# EAGLE schematic open-lab-VUSB-D (EAGLE 6.5.0)
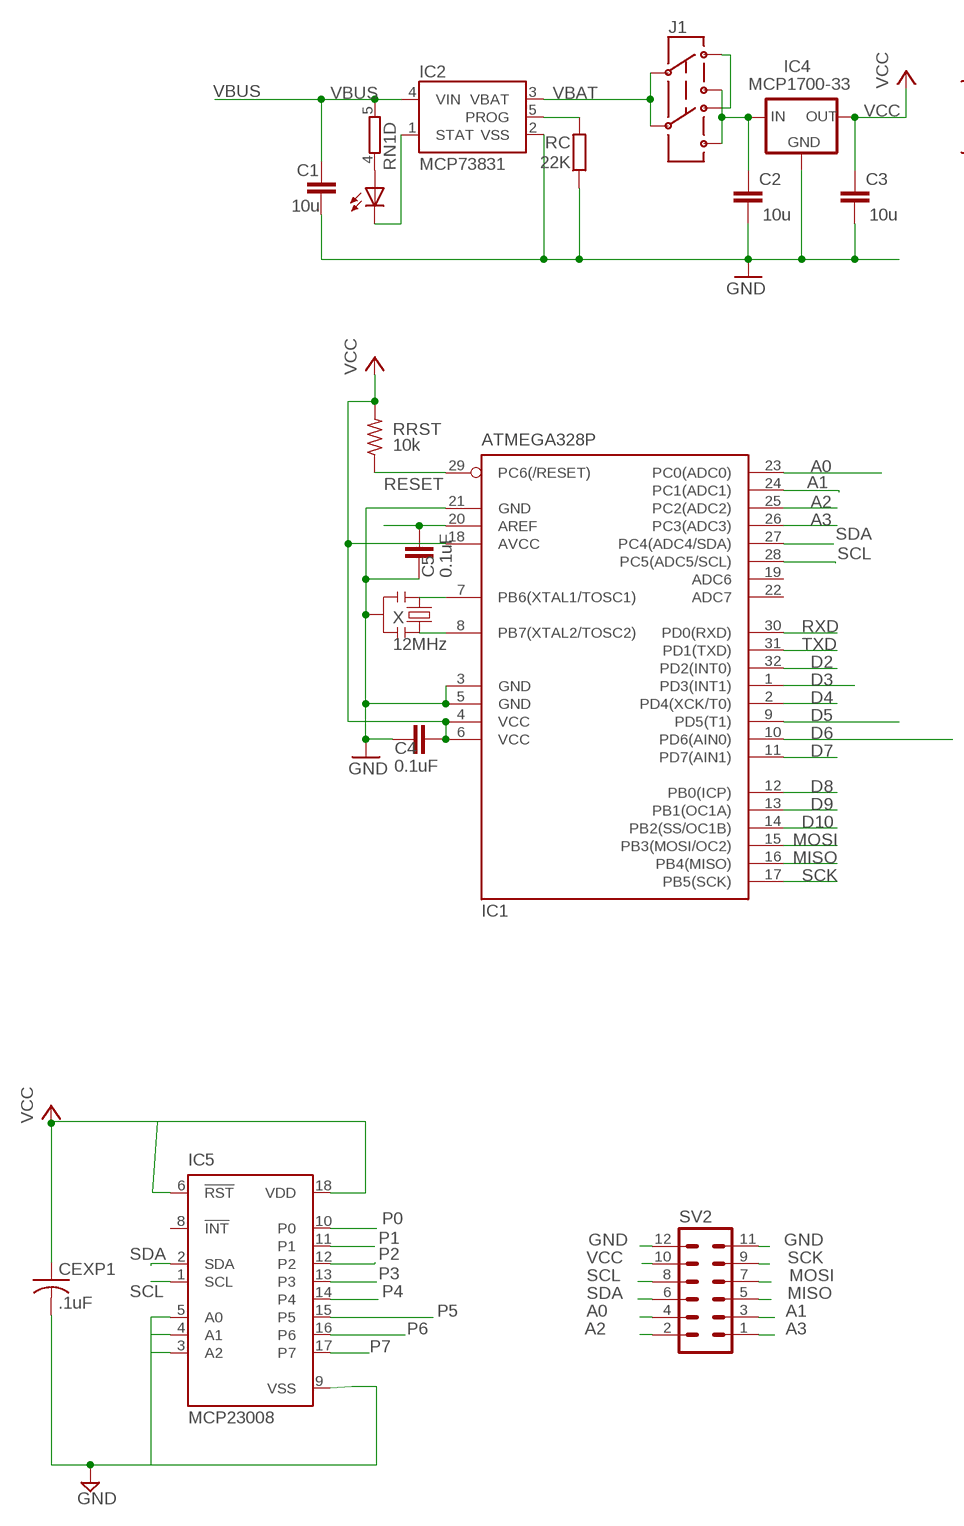
[diagram p0: schematic, sheet 1, part 1 of 2]
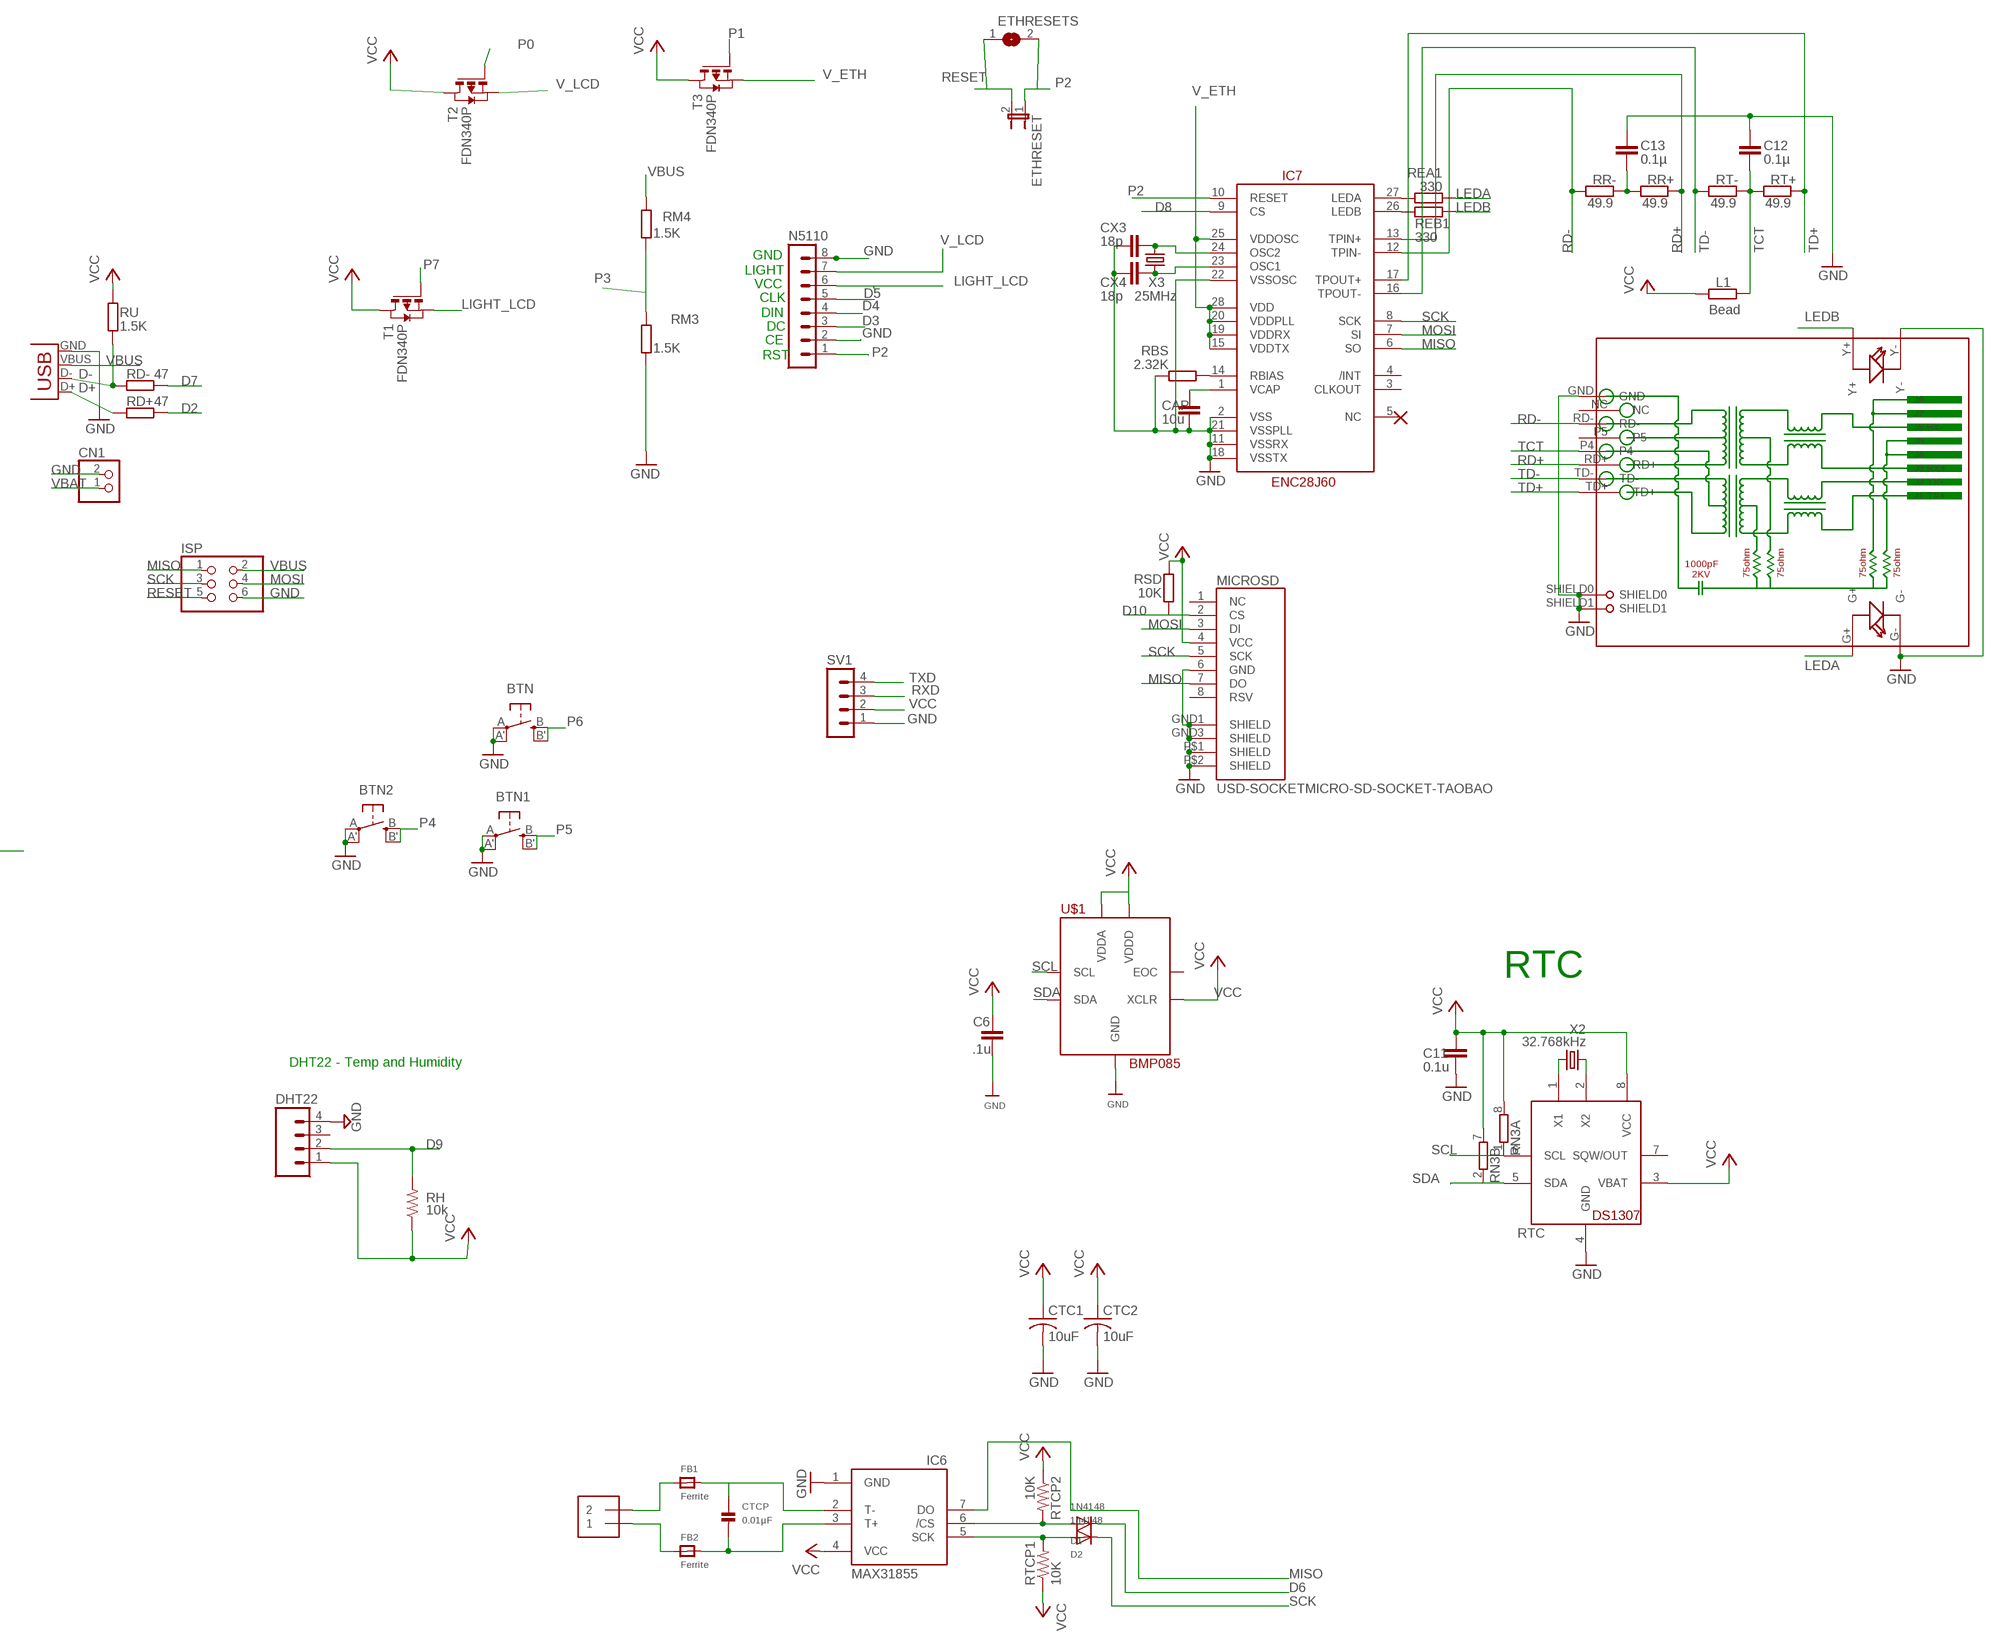
[diagram p1: schematic, sheet 1, part 2 of 2]

## Parts
BTN  EVQQ2  [EVQ-Q2]
BTN1  EVQQ2  [EVQ-Q2]
BTN2  EVQQ2  [EVQ-Q2]
C1  10u  C-EUC0805  [C0805]
C2  10u  C-EUC0805  [C0805]
C3  10u  C-EUC0805  [C0805]
C4  0.1uF  C-EUC0805  [C0805]
C5  0.1uF  C-EUC0805  [C0805]
C6  .1u  C-EUC0805  [C0805]
C11  0.1u  C-EUC0805  [C0805]
C12  0.1µ  C-EUC0805  [C0805]
C13  0.1µ  C-EUC0805  [C0805]
CAP  10u  C-EUC0805  [C0805]
CEXP1  .1uF  C-USC0805K  [C0805K]
CHG  0805  LEDCHIPLED_0805  [CHIPLED_0805]
CN1  JST_2PIN-SMT-RA  [JST-PH-2-SMT-RA]
CTC1  10uF  C-USC0805K  [C0805K]
CTC2  10uF  C-USC0805K  [C0805K]
CTCP  0.01µF  CAP_CERAMIC_0805  [_0805]
CX3  18p  C-EUC0805  [C0805]
CX4  18p  C-EUC0805  [C0805]
D1  1N4148  DIODESOD-323F  [SOD-323F]
D2  1n4148  DIODESOD-323F  [SOD-323F]
DHT22  M04LOCK  [1X04_LOCK]
ETHRESET  JP1E  [JP1]
ETHRESETS  SJ  [SJ]
FB1  Ferrite  FERRITE_0805  [_0805]
FB2  Ferrite  FERRITE_0805  [_0805]
IC1  ATMEGA328P  MEGA8-AI  [TQFP32-08]
IC2  MCP73831  [SOT23-5]
IC4  MCP1700-33  MCP1700SOT233  [SOT23]
IC5  MCP23008  MCP23008T  [SO18W]
IC6  MAX31855  MAX6675  [SO08]
IC7  ENC28J60  ENC28J60SO28LONG  [SOIC28WLONG]
ISP  PINHD-2X3  [2X03]
J1  AYZ0202  [AYZ0202]
L1  Bead  R-EU_R0805  [R0805]
MICROSD  USD-SOCKETMICRO-SD-SOCKET-TAOBAO  [MICRO-SD-SOCKET-TAOBAO]
N5110  MA08-1  [MA08-1]
RBS  2.32K  R-EU_R0805  [R0805]
RC  22K  R-EU_R0805  [R0805]
RD+  47  R-EU_R0805  [R0805]
RD-  47  R-EU_R0805  [R0805]
REA1  330  R-EU_R0805  [R0805]
REB1  330  R-EU_R0805  [R0805]
RH  10k  R-US_R0805  [R0805@1]
RJ45  HR911105A  [HR911105A]
RM3  1.5K  R-EU_R0805  [R0805]
RM4  1.5K  R-EU_R0805  [R0805]
RN1  4R-NEXB38V  [EXB38V]
RN3  4R-NEXB38V  [EXB38V]
RR+  49.9  R-EU_R0805  [R0805]
RR-  49.9  R-EU_R0805  [R0805]
RRST  10k  R-US_R0805  [R0805@1]
RSD  10K  R-EU_R0805  [R0805]
RT+  49.9  R-EU_R0805  [R0805]
RT-  49.9  R-EU_R0805  [R0805]
RTC  DS1307  DS1307SOIC  [SO08]
RTCP1  10K  R-US_R0805  [R0805]
RTCP2  10K  R-US_R0805  [R0805]
RU  1.5K  R-EU_R0805  [R0805]
SV1  MA04-1  [MA04-1]
SV2  MA06-2  [MA06-2]
T1  FDN340P  PMOSSOT23  [SOT-23]
T2  FDN340P  PMOSSOT23  [SOT-23]
T3  FDN340P  PMOSSOT23  [SOT-23]
TCPL  1X2-3.5MM  [1X2-3.5MM]
U$1  BMP085  [BMP085]
X  12MHz  RESONATORSMD  [RESONATOR-SMD]
X1  USBSMD  [USB-MINIB]
X2  32.768kHz  CRYSTALTC26H  [TC26H]
X3  25MHz  CRYSTALHC49UV  [HC49U-V]

## Nets
A0: IC1.23(PC0(ADC0)) SV2.4
A1: IC1.24(PC1(ADC1)) SV2.3
A2: IC1.25(PC2(ADC2)) SV2.2
A3: IC1.26(PC3(ADC3)) SV2.1
AREF: C5.2 IC1.20(AREF)
CS: D1.A IC6.6(/CS) RTCP2.2
D2: IC1.32(PD2(INT0)) RD+.2
D3: IC1.1(PD3(INT1)) N5110.3
D4: IC1.2(PD4(XCK/T0)) N5110.4
D5: IC1.9(PD5(T1)) N5110.5
D6: D1.C IC1.10(PD6(AIN0))
D7: IC1.11(PD7(AIN1)) RD-.2
D8: IC1.12(PB0(ICP)) IC7.9(CS)
D9: DHT22.2 IC1.13(PB1(OC1A)) RH.2
D10: IC1.14(PB2(SS/OC1B)) MICROSD.2(CS) RSD.1
D+: RD+.1 X1.D+
D-: RD-.1 RU.1 X1.D-
GND: BTN1.A'(P1) BTN1.A(P) BTN2.A'(P1) BTN2.A(P) BTN.A'(P1) BTN.A(P) C1.2 C2.2 C3.2 C4.1 C5.1 C6.2 C11.2 C12.1 C13.1 CAP.2 CEXP1.2 CN1.2 CTC1.2 CTC2.2 CX3.2 CX4.2 DHT22.4 IC1.3(GND) IC1.5(GND) IC1.21(GND) IC2.2(VSS) IC4.1(GND) IC5.3(A2) IC5.4(A1) IC5.5(A0) IC5.9(VSS) IC6.1(GND) IC7.2(VSS) IC7.11(VSSRX) IC7.18(VSSTX) IC7.21(VSSPLL) IC7.22(VSSOSC) ISP.6 MICROSD.6(GND) MICROSD.GND1(SHIELD) MICROSD.GND3(SHIELD) MICROSD.P$1(SHIELD) MICROSD.P$2(SHIELD) N5110.2 N5110.8 RBS.1 RC.1 RJ45.G- RJ45.GND RJ45.SHIELD0 RJ45.SHIELD1 RJ45.Y- RM3.1 RTC.4(GND) SV1.1 SV2.11 SV2.12 U$1.P$1(GND) X1.GND X.2
LEDA: REA1.2 RJ45.G+
LEDB: REB1.2 RJ45.Y+
LIGHT_LCD: N5110.6 T1.2(S)
MISO: IC1.16(PB4(MISO)) IC6.7(DO) IC7.6(SO) ISP.1 MICROSD.7(DO) SV2.5
MOSI: IC1.15(PB3(MOSI/OC2)) IC7.7(SI) ISP.4 MICROSD.3(DI) SV2.7
N$1: J1.3 J1.6
N$2: IC1.7(PB6(XTAL1/TOSC1)) X.1
N$3: IC1.8(PB7(XTAL2/TOSC2)) X.3
N$5: CHG.C IC2.1(STAT)
N$6: IC2.5(PROG) RC.2
N$8: FB1.1 TCPL.2
N$9: CTCP.1 FB1.2 IC6.2(T-)
N$10: CHG.A RN1.4
N$11: FB2.1 TCPL.1
N$12: CTCP.2 FB2.2 IC6.3(T+)
N$21: RTC.1(X1) X2.2
N$30: RTC.2(X2) X2.1
N$34: IC7.27(LEDA) REA1.1
N$37: IC7.26(LEDB) REB1.1
N$39: CAP.1 IC7.1(VCAP)
N$41: CX3.1 IC7.24(OSC2) X3.2
N$42: CX4.1 IC7.23(OSC1) X3.1
N$54: C13.2 RR+.2 RR-.1
N$59: IC7.14(RBIAS) RBS.2
P0: IC5.10(P0) T2.3(G)
P1: IC5.11(P1) T3.3(G)
P2: ETHRESET.1 ETHRESETS.2 IC5.12(P2) IC7.10(RESET) N5110.1
P3: IC5.13(P3) RM3.2 RM4.1
P4: BTN2.B'(S1) BTN2.B(S) IC5.14(P4)
P5: BTN1.B'(S1) BTN1.B(S) IC5.15(P5)
P6: BTN.B'(S1) BTN.B(S) IC5.16(P6)
P7: IC5.17(P7) T1.3(G)
RD+: IC7.13(TPIN+) RJ45.RD+ RR+.1
RD-: IC7.12(TPIN-) RJ45.RD- RR-.2
RESET: ETHRESET.2 ETHRESETS.1 IC1.29(PC6(/RESET)) ISP.5 RRST.1
RXD: IC1.30(PD0(RXD)) SV1.3
SCK: D2.C IC1.17(PB5(SCK)) IC7.8(SCK) ISP.3 MICROSD.5(SCK) SV2.9
SCK1: D2.A IC6.5(SCK) RTCP1.2
SCL: IC1.28(PC5(ADC5/SCL)) IC5.1(SCL) RN3.1 RTC.6(SCL) SV2.8 U$1.P$6(SCL)
SDA: IC1.27(PC4(ADC4/SDA)) IC5.2(SDA) RN3.2 RTC.5(SDA) SV2.6 U$1.P$7(SDA)
TCT: C12.2 L1.1 RJ45.P4 RT+.2 RT-.1
TD+: IC7.17(TPOUT+) RJ45.TD+ RT+.1
TD-: IC7.16(TPOUT-) RJ45.TD- RT-.2
TXD: IC1.31(PD1(TXD)) SV1.4
V_ETH: IC7.15(VDDTX) IC7.19(VDDRX) IC7.20(VDDPLL) IC7.25(VDDOSC) IC7.28(VDD) T3.2(S)
V_LCD: N5110.7 T2.2(S)
VBAT: CN1.1 IC2.3(VBAT) J1.2 J1.5
VBUS: C1.1 IC2.4(VIN) ISP.2 RM4.2 RN1.5 X1.VBUS
VCC: C3.1 C4.2 C6.1 C11.1 CEXP1.1 CTC1.1 CTC2.1 DHT22.1 IC1.4(VCC) IC1.6(VCC) IC1.18(AVCC) IC4.2(OUT) IC5.6(!RST) IC5.18(VDD) IC6.4(VCC) L1.2 MICROSD.4(VCC) RH.1 RN3.7 RN3.8 RRST.2 RSD.2 RTC.3(VBAT) RTC.8(VCC) RTCP1.1 RTCP2.1 RU.2 SV1.2 SV2.10 T1.1(D) T2.1(D) T3.1(D) U$1.P$3(VDDA) U$1.P$4(VDDD) U$1.P$8(XCLR)
VDD: C2.1 IC4.3(IN) J1.1 J1.4
Unconnected: DHT22.3 IC1.19(ADC6) IC1.22(ADC7) IC5.8(!INT) IC7.3(CLKOUT) IC7.4(/INT) IC7.5(NC) MICROSD.1(NC) MICROSD.8(RSV) RJ45.NC RJ45.P5 RN1.1 RN1.2 RN1.3 RN1.6 RN1.7 RN1.8 RN3.3 RN3.4 RN3.5 RN3.6 RTC.7(SQW/OUT) U$1.P$2(EOC)

## Notes on the sheet
- GND
- LIGHT
- VCC
- CLK
- DIN
- DC
- CE
- RST
- RTC
- DHT22 - Temp and Humidity

## Library data of the parts
BTN BTN1 BTN2 = adafruit:EVQQ2: SMT 6mm switch, EVQQ2 series http://www.ladyada.net/library/eagle
C1-C3 C6 C12 C13 CAP CX3 CX4 = resistor:C-EU: CAPACITOR, European symbol
C4 C5 C11 = rcl:C-EU: CAPACITOR, European symbol
CEXP1 CTC1 CTC2 = adafruit:C-US: CAPACITOR, American symbol
CHG = led:LED: LED OSRAM: - CHIPLED LG R971, LG N971, LY N971, LG Q971, LY Q971, LO R971, LY R971 LH N974, LH R974 LS Q976, LO Q976, LY Q976 LO Q996 - Hyper CHIPLED LW Q18S LB Q993, LB Q99A, LB R99A - SideLED LS A670, LO A670, LY A670, LG A670, LP A670 LB A673, LV A673, LT A673, LW A673 LH A674 LY A675 LS A676, LA A676, LO A676, LY A676, LW A676 LS A679, LY A679, LG A679 - Hyper Micro SIDELED® LS Y876, LA Y876, LO Y876, LY Y876 LT Y87S - SmartLED LW L88C, LW L88S LB L89C, LB L89S, LG L890 LS L89K, LO L89K, LY L89K LS L896, LA L896, LO L896, LY L896 - TOPLED LS T670, LO T670, LY T670, LG T670, LP T670 LSG T670, LSP T670, LSY T670, LOP T670, LYG T670 LG T671, LOG T671, LSG T671 LB T673, LV T673, LT T673, LW T673 LH T674 LS T676, LA T676, LO T676, LY T676, LB T676, LH T676, LSB T676, LW T676 LB T67C, LV T67C, LT T67C, LS T67K, LO T67K, LY T67K, LW E67C LS E67B, LA E67B, LO E67B, LY E67B, LB E67C, LV E67C, LT E67C LW T67C LS T679, LY T679, LG T679 LS T770, LO T770, LY T770, LG T770, LP T770 LB T773, LV T773, LT T773, LW T773 LH T774 LS E675, LA E675, LY E675, LS T675 LS T776, LA T776, LO T776, LY T776, LB T776 LHGB T686 LT T68C, LB T68C - Hyper Mini TOPLED® LB M676 - Mini TOPLED Santana® LG M470 LS M47K, LO M47K, LY M47K Source: http://www.osram.convergy.de LUXEON: - LUMILED® LXK2-PW12-R00, LXK2-PW12-S00, LXK2-PW14-U00, LXK2-PW14-V00 LXK2-PM12-R00, LXK2-PM12-S00, LXK2-PM14-U00 LXK2-PE12-Q00, LXK2-PE12-R00, LXK2-PE12-S00, LXK2-PE14-T00, LXK2-PE14-U00 LXK2-PB12-K00, LXK2-PB12-L00, LXK2-PB12-M00, LXK2-PB14-N00, LXK2-PB14-P00, LXK2-PB14-Q00 LXK2-PR12-L00, LXK2-PR12-M00, LXK2-PR14-Q00, LXK2-PR14-R00 LXK2-PD12-Q00, LXK2-PD12-R00, LXK2-PD12-S00 LXK2-PH12-R00, LXK2-PH12-S00 LXK2-PL12-P00, LXK2-PL12-Q00, LXK2-PL12-R00 Source: www.luxeon.com KINGBRIGHT: KA-3528ASYC Source: www.kingbright.com
CN1 = adafruit:JST_2PIN: JST 2-Pin Connectors of various flavors SMT-RA (S2B-PH-SM4) 4UConnector #17311 SMT (B2B-PH-SM4) THM-RA (S2B-PH) THM (B2B-PH)
CTCP = microbuilder:CAP_CERAMIC: Ceramic Capacitors 0402 - 0402 Surface Mount Capacitors 16pF 50V 5% [Digikey: 445-4899-2-ND] 18pF 50V 5% [Digikey: 490-1281-2-ND] 22pF 50V 5% [Digikey: 490-1283-2-ND] 68pF 50V 5% [Digikey: 490-1289-2-ND] 0.1uF 10V 10% [Digikey: 490-1318-2-ND] 1.0uF 6.3V 10% [Digikey: 490-1320-2-ND] 0603 - 0603 Surface Mount Capacitors 16 pF 50V 5% [Digikey: 445-5051-2-ND] 22 pF 50V [Digikey: PCC220ACVTR-ND] 33 pF 50V 5% [Digikey: 490-1415-1-ND] 56pF 50V 5% [Digikey: 490-1421-1-ND] 220pF 50V 5% [Digikey: 445-1285-1-ND] 680 pF 50V 2200 pF 50V 5% C0G [Digikey: 445-1297-1-ND] 5600 pF 100V 5% X7R [Digikey: 478-3711-1-ND] 0.1 µF 25V 10% [Digikey: PCC2277TR-ND] 0.22 µF 16V 10% X7R [Digikey: 445-1318-1-ND] 1.0 µF 25V 10% [Digikey: 445-5146-2-ND] 0603 - RF Specific 3pF 250V +/-0.1pF RF [Digikey: 712-1347-1-ND] 18 pF 250V 5% [Digikey: 478-3505-1-ND or 712-1322-1-ND] 56 pF 250V 5% C0G RF [Digikey: 490-4867-1-ND] 68 pF 250V RF [Digikey: 490-4868-1-ND] 0805 - 0805 Surface Mount Capacitors 220 pF 250V 2% RF Ceramic Capacitor [Digikey: 712-1398-1-ND] 1000 pF 50V 2% NP0 Ceramic Capacitor [Digikey: 478-3760-1-ND] 0.1 µF 25V 10% Ceramic Capacitor [Digikey: PCC1828TR-ND] 1.0 µF 16V 10% Ceramic Capacitor[Digikey: 490-1691-2-ND] 10.0 µF 10V 10% Ceramic Capacitor[Digikey: 709-1228-1-ND] 10.0 uF 16V 10% Ceramic Capacitor [Digikey: 478-5165-2-ND] 47 uF 6.3V 20% Ceramic Capacitor [Digikey: 587-1779-1-ND or 399-5506-1-ND] 1206 - 1206 Surface Mount Capacitors 47uF 10V 20% Ceramic Capacitor [Digikey: 490-5528-1-ND or 399-5508-1-ND or 445-6010-1-ND] 100uF 6.3V -20%, +80% Y5V Ceramic Capacitor (Digikey: 490-4512-1-ND, Mouser: 81-GRM31CF50J107ZE1L)
D1 D2 = adafruit:DIODE: Diode SMADIODE - SMA Surface Mount Package 20V 1A Schottky Diode Digikey: 641-1014-6-ND DO-1N4148 - Through Hole Small Current Diode SOD-123 20V 1 A (.5mV Vf) Schottky Diode - Digikey: MBRX120TPMSCT-ND SOD-323 10V 570mA (.38mV Vf, 3ns) Schottky Diode - Digikey: ZLLS410CT-ND SOD-523 30V 30mA Schottky Diode (RB751S-40TE61) - Digikey: RB751S-40TE61CT-ND SOT23-R/W - SOT23 Package (R = Solder Paste/Reflow Ovens, W = Hand-Soldering) BAT54Film 40V 300mA - Digikey: 497-7162-1-ND
DHT22 = SparkFun-Connectors:M04: Header 4 Standard 4-pin 0.1" header. Use with straight break away headers (SKU : PRT-00116), right angle break away headers (PRT-00553), swiss pins (PRT-00743), machine pins (PRT-00117), and female headers (PRT-00115). Molex polarized connector foot print use with SKU : PRT-08231 with associated crimp pins and housings. 1MM SMD Version SKU: PRT-10208
ETHRESET = jumper:JP1E: JUMPER
ETHRESETS = jumper:SJ: SMD solder JUMPER
FB1 FB2 = microbuilder:FERRITE: Ferrite Bead 0603 MMZ1608B121C - 120 Ohm @ 100MHz, 600mA, 0.15 Ohm DC Resistance - Digikey: 445-2164-1-ND BK1608HW121-T - 120 Ohm, 600mA Ferrite Chip - Digikey: 587-1876-2-ND 0805 HZ0805B272R-10 - 2.7K Ohm @ 100MHz, 200mA, 0.8 Ohm DC Resistance - Digikey: 240-2504-1-ND (see also Murata BLM21BD272SN1L) MMZ2012Y152B - 1.5K Ohm @ 100MHz, 500mA, 0.4 Ohm DC Resistance - Digikey: 445-1560-1-ND - Mainly for high frequency (80-400MHz) MMZ2012R102A - 1K Ohm @ 100MHz, 500mA, 0.3 Ohm DC Resistance - Digikey: 445-1555-2-ND - More general purpose (10-200MHz)
IC1 = atmel:MEGA8: MICROCONTROLLER 8 Kbytes FLASH, 1 kbytes SRAM, 512 bytes EEPROM, USART, 6-channel 10 bit ADC, 2-channel 8 bit ADC Pin compatible with Atmega48, ATMega88, ATMega168 Source: avr.lbr; MPN: ATMEGA8-16AU; OC_FARNELL: 9171371; OC_NEWARK: 73M8863
IC2 = SparkFunNew:MCP73831: Microchip's MCP73831 Miniature single cell, fully integrated Li-Ion, Li-polymer charge management controller http://ww1.microchip.com/downloads/en/DeviceDoc/21984a.pdf
IC4 = adafruit:MCP1700: VOLTAGE REGULATOR
IC5 = JeeLabs:MCP23008: I2C-Bus Remote 8-bit I/O expander http://www.semiconductors.philips.com/acrobat_download/datasheets/PCF8574_4.pdf
IC6 = adafruit:MAX6675
IC7 = SparkFun:ENC28J60
ISP = pinhead:PINHD-2X3: PIN HEADER
J1 = SparkFunNew:AYZ0202: SPDT Slide Switch Simple SMD single-pull double-throw slide switch. Good for less than 350mA power switch, switching UARTs between devices, etc. Spark Fun Electronics SKU : COM-00597
L1 RBS RC RD+ RD- REA1 REB1 RM3 RM4 RR+ RR- RSD RT+ RT- RU = rcl:R-EU_: RESISTOR, European symbol
MICROSD = SparkFunNew:USD-SOCKET: microSD Socket Push-push type uSD socket. Schematic element and footprint production proven. Spark Fun Electronics SKU : PRT-00127. tDoc lines correctly indicate media card edge positions when inserting (unlocked, locked, depressed).
N5110 = con-lstb:MA08-1: PIN HEADER; OC_FARNELL: unknown; OC_NEWARK: unknown
RH RRST = rcl:R-US_: RESISTOR, American symbol
RJ45 = CONNECTER:HR911105A
RN1 RN3 = resistor-dil:4R-N: Array Chip Resistor Source: RS Component / Phycomp; OC_FARNELL: unknown; OC_NEWARK: unknown
RTC = adafruit:DS1307: DS1307 Real time clock (RTC) with battery backup ability. Talk to it via i2c
RTCP1 RTCP2 = adafruit:R-US_: RESISTOR, American symbol
SV1 = con-lstb:MA04-1: PIN HEADER; OC_FARNELL: unknown; OC_NEWARK: unknown
SV2 = con-lstb:MA06-2: PIN HEADER; OC_FARNELL: unknown; OC_NEWARK: unknown
T1-T3 = zetex:PMOSSOT23: MOS FET
TCPL = adafruit:1X2: 3.5mm Terminal block http://www.ladyada.net/library/pcb/eaglelibrary.html
U$1 = JeeLabs:BMP085: BMP086 Bosch Digital Pressure Sensor
X = SparkFunNew:RESONATOR: Resonator Small SMD resonator. This is the itty bitty 10/20MHz resonators with built in caps. CSTCE10M0G55 and CSTCE20M0V53. Footprint has been reviewed closely but hasn't been tested yet.
X1 = SparkFun:USB: USB Connectors USB-B-PTH is fully proven SKU : PRT-00139 USB-miniB is fully proven SKU : PRT-00587 USB-A-PCB is untested. USB-A-H is throughly reviewed, but untested. Spark Fun Electronics SKU : PRT-00437 USB-B-SMT is throughly reviewed, but untested. Needs silkscreen touching up. USB-A-S has not been used/tested USB-MB-H has not been used/tested
X2 = crystal:CRYSTAL: CRYSTAL; OC_FARNELL: unknown; OC_NEWARK: unknown
X3 = SparkFun:CRYSTAL: Crystals Various standard crystals. Proven footprints. Spark Fun Electronics SKU : COM-00534

## Net classes
0 default: width 0.254 mm, clearance 0.254 mm
1 power: width 0.381 mm
3 usbvcc: width 0.508 mm, drill 0.61 mm, clearance 0.254 mm